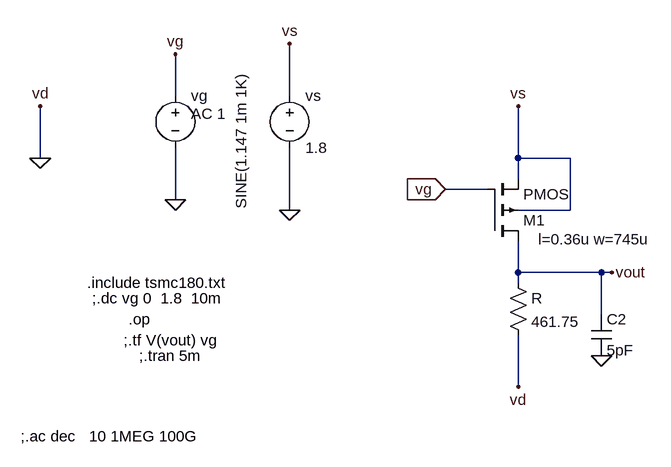
[diagram p0: schematic CSAmp_GBW800Mhz_PMOS.asc]
CSAmp_GBW800Mhz_PMOS.asc, the LTspice schematic file:
Version 4
SHEET 1 968 680
WIRE 192 112 192 48
WIRE 368 112 368 32
WIRE -16 208 -16 128
WIRE 720 208 720 128
WIRE 800 208 720 208
WIRE 720 240 720 208
WIRE 672 256 608 256
WIRE 192 272 192 192
WIRE 368 288 368 192
WIRE 800 288 800 208
WIRE 800 288 720 288
WIRE 720 384 720 336
WIRE 848 384 720 384
WIRE 864 384 848 384
WIRE 720 400 720 384
WIRE 848 448 848 384
WIRE 720 560 720 480
FLAG 192 272 0
FLAG 368 288 0
FLAG 192 48 vg
FLAG 368 32 vs
FLAG 608 256 vg
IOPIN 608 256 In
FLAG 720 128 vs
FLAG 720 560 vd
FLAG -16 208 0
FLAG -16 128 vd
FLAG 864 384 vout
FLAG 848 512 0
SYMBOL voltage 192 96 R0
WINDOW 3 101 -19 VRight 2
WINDOW 123 24 44 Left 2
WINDOW 39 0 0 Left 0
SYMATTR Value SINE(1.147 1m 1K)
SYMATTR Value2 AC 1
SYMATTR InstName vg
SYMBOL voltage 368 96 R0
WINDOW 123 0 0 Left 0
WINDOW 39 0 0 Left 0
SYMATTR InstName vs
SYMATTR Value 1.8
SYMBOL pmos4 672 336 M180
WINDOW 123 79 3 Left 2
SYMATTR Value2 l=0.36u w=745u
SYMATTR InstName M1
SYMBOL res 704 384 R0
SYMATTR InstName R
SYMATTR Value 461.75
SYMBOL cap 832 448 R0
SYMATTR InstName C2
SYMATTR Value 5pF
TEXT 56 400 Left 2 !.include tsmc180.txt
TEXT 64 424 Left 2 !;.dc vg 0  1.8  10m
TEXT 120 456 Left 2 !.op
TEXT 112 488 Left 2 !;.tf V(vout) vg
TEXT 136 512 Left 2 !;.tran 5m
TEXT -46 636 Left 2 !;.ac dec   10 1MEG 100G

The netlist it stands for:
* CSAmp_GBW800Mhz_PMOS.asc
vg vg 0 SINE(1.147 1m 1K) AC 1
vs vs 0 1.8
M1 vout vg vs vs PMOS l=0.36u w=745u
R vout 0 461.75
C2 vout 0 5pF
.model NMOS NMOS
.model PMOS PMOS
.lib standard.mos
.include tsmc180.txt
;.dc vg 0  1.8  10m
.op
;.tf V(vout) vg
;.tran 5m
;.ac dec   10 1MEG 100G
.backanno
.end